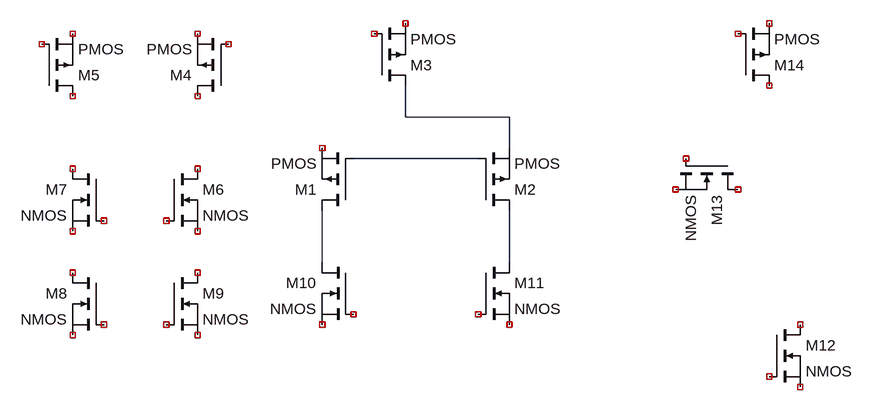
[diagram p0: schematic 4_50.asc]
4_50.asc, the LTspice schematic file:
Version 4
SHEET 1 948 680
WIRE 256 -112 256 -160
WIRE 416 -112 256 -112
WIRE 416 -64 416 -112
WIRE 368 -48 176 -48
WIRE 128 112 128 32
WIRE 416 112 416 32
SYMBOL pmos 176 32 R180
SYMATTR InstName M1
SYMBOL pmos 368 32 M180
SYMATTR InstName M2
SYMBOL pmos 208 -160 M180
SYMATTR InstName M3
SYMBOL pmos -16 -144 R180
SYMATTR InstName M4
SYMBOL pmos -304 -144 M180
SYMATTR InstName M5
SYMBOL nmos -112 -32 R0
SYMATTR InstName M6
SYMBOL nmos -208 -32 M0
SYMATTR InstName M7
SYMBOL nmos -208 128 M0
SYMATTR InstName M8
SYMBOL nmos -112 128 R0
SYMATTR InstName M9
SYMBOL nmos 176 112 M0
SYMATTR InstName M10
SYMBOL nmos 368 112 R0
SYMATTR InstName M11
SYMBOL nmos 816 208 R0
SYMATTR InstName M12
SYMBOL nmos 768 -48 R90
SYMATTR InstName M13
SYMBOL pmos 768 -160 M180
SYMATTR InstName M14

The netlist it stands for:
* 4_50.asc
M1 N003 N002 NC_01 NC_01 PMOS
M2 N004 N002 N001 N001 PMOS
M3 N001 NC_02 NC_03 NC_03 PMOS
M4 NC_04 NC_05 NC_06 NC_06 PMOS
M5 NC_07 NC_08 NC_09 NC_09 PMOS
M6 NC_10 NC_11 NC_12 NC_12 NMOS
M7 NC_13 NC_14 NC_15 NC_15 NMOS
M8 NC_16 NC_17 NC_18 NC_18 NMOS
M9 NC_19 NC_20 NC_21 NC_21 NMOS
M10 N003 NC_22 NC_23 NC_23 NMOS
M11 N004 NC_24 NC_25 NC_25 NMOS
M12 NC_26 NC_27 NC_28 NC_28 NMOS
M13 NC_29 NC_30 NC_31 NC_31 NMOS
M14 NC_32 NC_33 NC_34 NC_34 PMOS
.model NMOS NMOS
.model PMOS PMOS
.lib standard.mos
.backanno
.end